# Altium schematic sheet Accel.SchDoc
size Letter
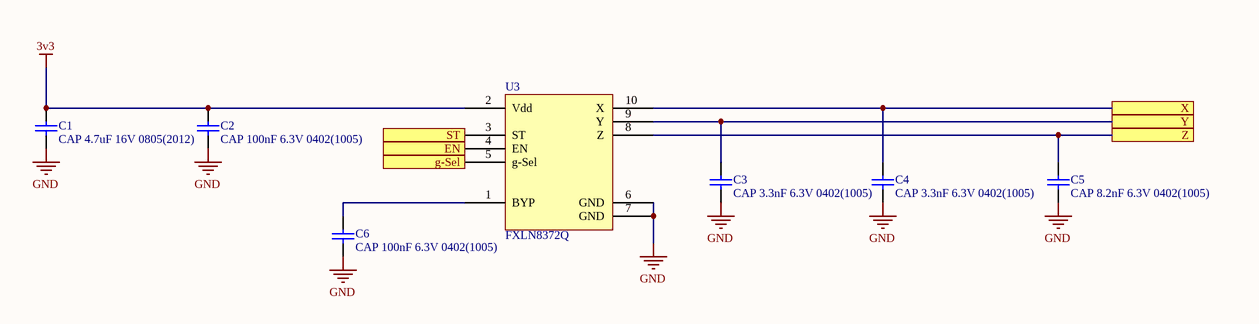
[diagram p0: Accel.SchDoc]

## Parts
C1  CAP 4.7uF 16V 0805(2012)  [CAPC0805(2012)155_M]
C2  CAP 100nF 6.3V 0402(1005)  [CAPC0402(1005)60_M]
C3  CAP 3.3nF 6.3V 0402(1005)  [CAPC0402(1005)60_M]
C4  CAP 3.3nF 6.3V 0402(1005)  [CAPC0402(1005)60_M]
C5  CAP 8.2nF 6.3V 0402(1005)  [CAPC0402(1005)60_L]
C6  CAP 100nF 6.3V 0402(1005)  [CAPC0402(1005)60_M]
U3  FXLN8372Q  [QFN65P300X300X100-12N]

## Ports
EN, g-Sel, ST, X, Y, Z

## Nets
3v3: C1.2 C2.2 U3.2(Vdd)
GND: C1.1 C2.1 C3.1 C4.1 C5.1 C6.1 U3.6(GND) U3.7(GND)
EN: U3.4(EN) ; port EN
g-Sel: U3.5(g-Sel) ; port g-Sel
ST: U3.3(ST) ; port ST
X: C4.2 U3.10(X) ; port X
Y: C3.2 U3.9(Y) ; port Y
Z: C5.2 U3.8(Z) ; port Z
NetC6_2: C6.2 U3.1(BYP)

## Notes on the sheet
- Title
- Size:
- Date:
- Letter
- Number:
- Time:
- Revision:
- Sheet
- of
- Copyright 2019
- Specialized Solutions LLC
- 206 W Lincoln Hwy STE B
- New Haven, IN 46774
- www.specsolns.com <http://www.specsolns.com>
- File:

## Library data of the parts
C1 = CMP-1036-04892-1: CAP 4.7uF 16V ±20% 0805 (2012 Metric) Thickness 1.55mm SMD; Case-EIA: 0805; Tolerance: Â±20%; Case-Metric: 2012; Rated Voltage: 16 V; Value: 4.7uF; Max Thickness: 1.55 mm; Technology: SMT
C2 C6 = CMP-1034-02062-1: CAP 100nF 6.3V ±20% 0402 (1005 Metric) Thickness 0.6mm SMD; Case-EIA: 0402; Tolerance: Â±20%; Case-Metric: 1005; Value: 100nF; Technology: SMT; Max Thickness: 0.6 mm; Rated Voltage: 6.3 V
C3 C4 = CMP-1034-01767-1: CAP 3.3nF 6.3V ±20% 0402 (1005 Metric) Thickness 0.6mm SMD; Case-EIA: 0402; Tolerance: Â±20%; Case-Metric: 1005; Rated Voltage: 6.3 V; Value: 3.3nF; Technology: SMT; Max Thickness: 0.6 mm
C5 = CMP-1034-01854-1: CAP 8.2nF 6.3V ±20% 0402 (1005 Metric) Thickness 0.6mm SMD; Tolerance: Â±20%; Case-Metric: 1005; Case-EIA: 0402; Value: 8.2nF; Technology: SMT; Rated Voltage: 6.3 V; Max Thickness: 0.6 mm
U3 = FXLN8372Q: Xtrinsic FXLN83xxQ 3-Axis Low-Power Analog-Output Accelerometer